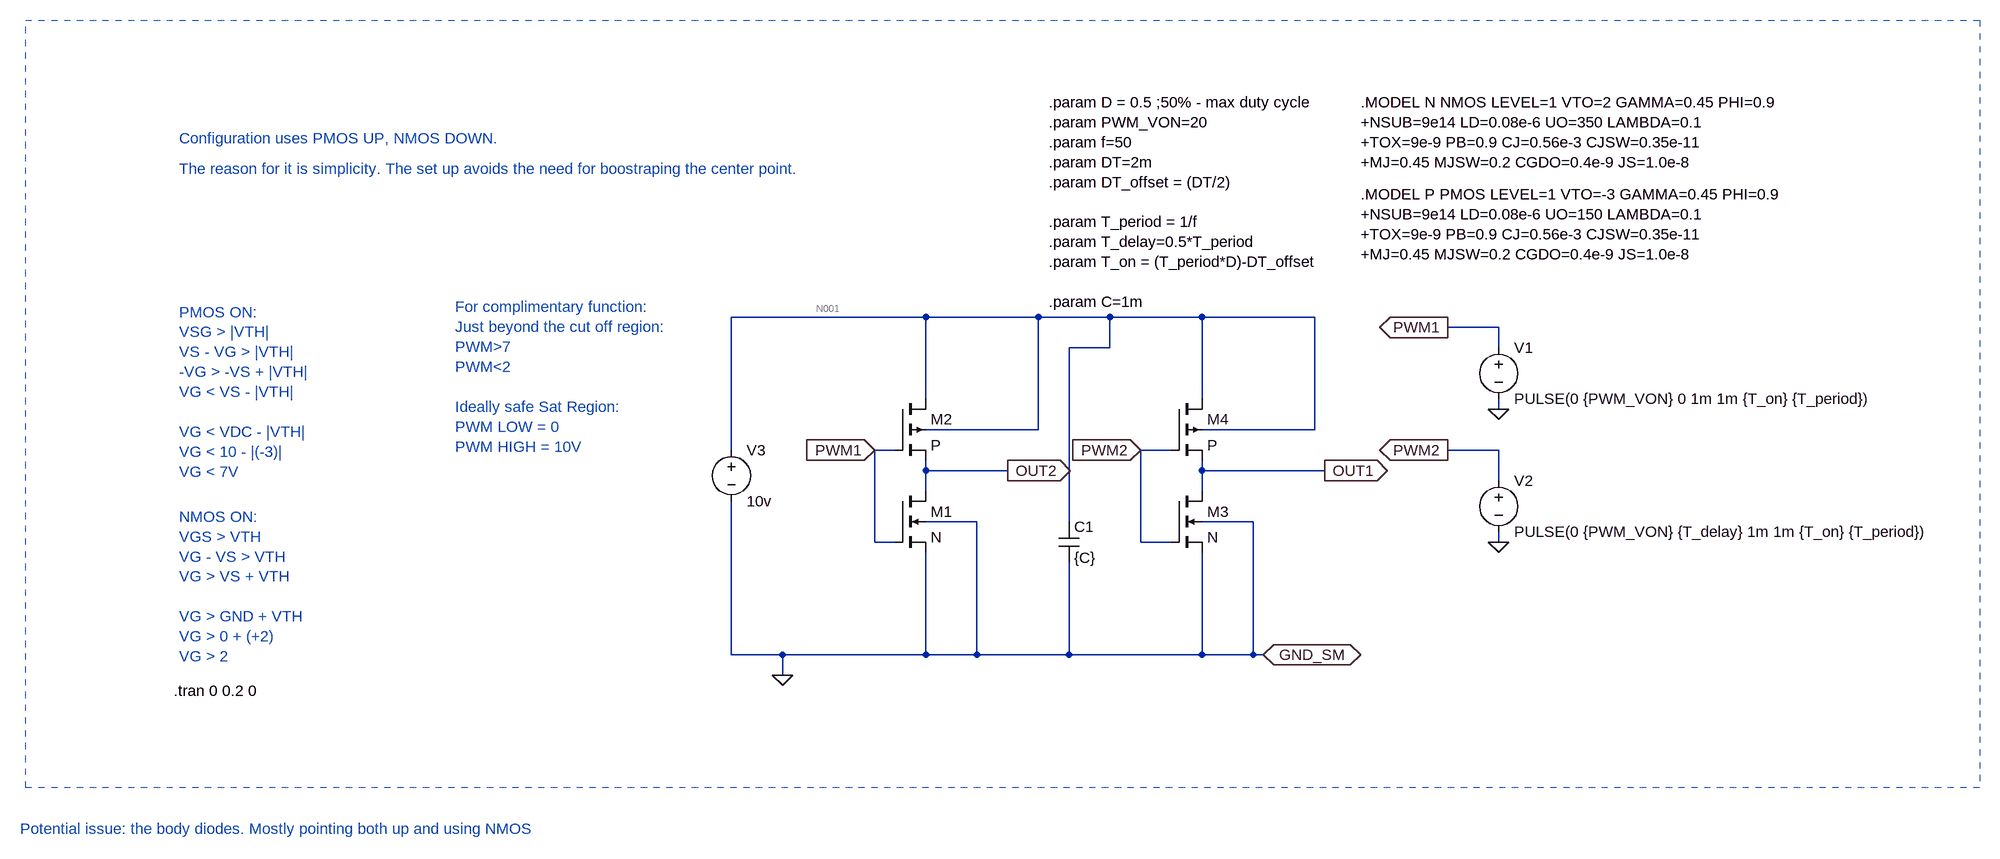
[diagram p0: schematic H-Bridge-SM.asc]
H-Bridge-SM.asc, the LTspice schematic file:
Version 4.1
SHEET 1 3540 848
WIRE 1728 32 1424 32
WIRE 1904 32 1728 32
WIRE 2016 32 1904 32
WIRE 2160 32 2016 32
WIRE 2336 32 2160 32
WIRE 2624 48 2544 48
WIRE 2016 80 2016 32
WIRE 2016 80 1952 80
WIRE 2624 80 2624 48
WIRE 1728 160 1728 32
WIRE 2160 160 2160 32
WIRE 2624 176 2624 160
WIRE 1904 208 1904 32
WIRE 1904 208 1728 208
WIRE 2336 208 2336 32
WIRE 2336 208 2160 208
WIRE 1424 240 1424 32
WIRE 1680 240 1648 240
WIRE 2112 240 2064 240
WIRE 2624 240 2544 240
WIRE 1728 272 1728 256
WIRE 1856 272 1728 272
WIRE 2160 272 2160 256
WIRE 2352 272 2160 272
WIRE 2624 288 2624 240
WIRE 1728 304 1728 272
WIRE 2160 304 2160 272
WIRE 1808 352 1728 352
WIRE 1952 352 1952 80
WIRE 2240 352 2160 352
WIRE 1648 384 1648 240
WIRE 1680 384 1648 384
WIRE 2064 384 2064 240
WIRE 2112 384 2064 384
WIRE 2624 384 2624 368
WIRE 1424 560 1424 320
WIRE 1504 560 1424 560
WIRE 1728 560 1728 400
WIRE 1728 560 1504 560
WIRE 1808 560 1808 352
WIRE 1808 560 1728 560
WIRE 1952 560 1952 416
WIRE 1952 560 1808 560
WIRE 2160 560 2160 400
WIRE 2160 560 1952 560
WIRE 2240 560 2240 352
WIRE 2240 560 2160 560
WIRE 2256 560 2240 560
WIRE 1504 592 1504 560
FLAG 1648 240 PWM1
IOPIN 1648 240 In
FLAG 2064 240 PWM2
IOPIN 2064 240 In
FLAG 1856 272 OUT2
IOPIN 1856 272 Out
FLAG 2352 272 OUT1
IOPIN 2352 272 Out
FLAG 2624 176 0
FLAG 2624 384 0
FLAG 2544 48 PWM1
IOPIN 2544 48 Out
FLAG 2544 240 PWM2
IOPIN 2544 240 Out
FLAG 2256 560 GND_SM
IOPIN 2256 560 BiDir
FLAG 1504 592 0
SYMBOL nmos4 1680 304 R0
SYMATTR InstName M1
SYMATTR Value N
SYMBOL pmos4 1680 160 R0
SYMATTR InstName M2
SYMATTR Value P
SYMBOL nmos4 2112 304 R0
SYMATTR InstName M3
SYMATTR Value N
SYMBOL pmos4 2112 160 R0
SYMATTR InstName M4
SYMATTR Value P
SYMBOL voltage 2624 64 R0
WINDOW 123 0 0 Left 0
WINDOW 39 0 0 Left 0
SYMATTR InstName V1
SYMATTR Value PULSE(0 {PWM_VON} 0 1m 1m {T_on} {T_period})
SYMBOL voltage 2624 272 R0
WINDOW 123 0 0 Left 0
WINDOW 39 0 0 Left 0
SYMATTR InstName V2
SYMATTR Value PULSE(0 {PWM_VON} {T_delay} 1m 1m {T_on} {T_period})
SYMBOL voltage 1424 224 R0
WINDOW 123 0 0 Left 0
WINDOW 39 0 0 Left 0
SYMATTR InstName V3
SYMATTR Value 10v
SYMBOL cap 1936 352 R0
SYMATTR InstName C1
SYMATTR Value {C}
TEXT 2408 -304 Left 2 !.MODEL N NMOS LEVEL=1 VTO=2 GAMMA=0.45 PHI=0.9\n+NSUB=9e14 LD=0.08e-6 UO=350 LAMBDA=0.1\n+TOX=9e-9 PB=0.9 CJ=0.56e-3 CJSW=0.35e-11\n+MJ=0.45 MJSW=0.2 CGDO=0.4e-9 JS=1.0e-8
TEXT 2408 -160 Left 2 !.MODEL P PMOS LEVEL=1 VTO=-3 GAMMA=0.45 PHI=0.9\n+NSUB=9e14 LD=0.08e-6 UO=150 LAMBDA=0.1\n+TOX=9e-9 PB=0.9 CJ=0.56e-3 CJSW=0.35e-11\n+MJ=0.45 MJSW=0.2 CGDO=0.4e-9 JS=1.0e-8
TEXT 560 -248 Left 2 ;Configuration uses PMOS UP, NMOS DOWN.
TEXT 560 -200 Left 2 ;The reason for it is simplicity. The set up avoids the need for boostraping the center point.
TEXT 560 24 Left 2 ;PMOS ON: \nVSG > |VTH| \nVS - VG > |VTH| \n-VG > -VS + |VTH| \nVG < VS - |VTH| \n \nVG < VDC - |VTH| \nVG < 10 - |(-3)|\nVG < 7V
TEXT 560 344 Left 2 ;NMOS ON:\nVGS > VTH\nVG - VS > VTH \nVG > VS + VTH\n \nVG > GND + VTH \nVG > 0 + (+2) \nVG > 2
TEXT 992 16 Left 2 ;For complimentary function: \nJust beyond the cut off region: \nPWM>7 \nPWM<2\n \nIdeally safe Sat Region: \nPWM LOW = 0\nPWM HIGH = 10V
TEXT 552 616 Left 2 !.tran 0 0.2 0
TEXT 1920 -304 Left 2 !.param D = 0.5 ;50% - max duty cycle\n.param PWM_VON=20\n.param f=50\n.param DT=2m\n.param DT_offset = (DT/2)\n \n.param T_period = 1/f\n.param T_delay=0.5*T_period\n.param T_on = (T_period*D)-DT_offset\n \n.param C=1m
TEXT 312 832 Left 2 ;Potential issue: the body diodes. Mostly pointing both up and using NMOS
RECTANGLE Normal 3376 768 320 -432 2

The netlist it stands for:
* H-Bridge-SM.asc
M1 OUT2 PWM1 0 0 N
M2 N001 PWM1 OUT2 N001 P
M3 OUT1 PWM2 0 0 N
M4 N001 PWM2 OUT1 N001 P
V1 PWM1 0 PULSE(0 {PWM_VON} 0 1m 1m {T_on} {T_period})
V2 PWM2 0 PULSE(0 {PWM_VON} {T_delay} 1m 1m {T_on} {T_period})
V3 N001 0 10v
C1 N001 0 {C}
.model NMOS NMOS
.model PMOS PMOS
.lib standard.mos
.MODEL N NMOS LEVEL=1 VTO=2 GAMMA=0.45 PHI=0.9
+NSUB=9e14 LD=0.08e-6 UO=350 LAMBDA=0.1
+TOX=9e-9 PB=0.9 CJ=0.56e-3 CJSW=0.35e-11
+MJ=0.45 MJSW=0.2 CGDO=0.4e-9 JS=1.0e-8
.MODEL P PMOS LEVEL=1 VTO=-3 GAMMA=0.45 PHI=0.9
+NSUB=9e14 LD=0.08e-6 UO=150 LAMBDA=0.1
+TOX=9e-9 PB=0.9 CJ=0.56e-3 CJSW=0.35e-11
+MJ=0.45 MJSW=0.2 CGDO=0.4e-9 JS=1.0e-8
* Configuration uses PMOS UP, NMOS DOWN.
* The reason for it is simplicity. The set up avoids the need for boostraping the center point.
* PMOS ON:
* VSG > |VTH|
* VS - VG > |VTH|
* -VG > -VS + |VTH|
* VG < VS - |VTH|
* VG < VDC - |VTH|
* VG < 10 - |(-3)|
* VG < 7V
* NMOS ON:
* VGS > VTH
* VG - VS > VTH
* VG > VS + VTH
* VG > GND + VTH
* VG > 0 + (+2)
* VG > 2
* For complimentary function:
* Just beyond the cut off region:
* PWM>7
* PWM<2
* Ideally safe Sat Region:
* PWM LOW = 0
* PWM HIGH = 10V
.tran 0 0.2 0
.param D = 0.5 ;50% - max duty cycle
.param PWM_VON=20
.param f=50
.param DT=2m
.param DT_offset = (DT/2)
.param T_period = 1/f
.param T_delay=0.5*T_period
.param T_on = (T_period*D)-DT_offset
.param C=1m
* Potential issue: the body diodes. Mostly pointing both up and using NMOS
.backanno
.end

* Results of the author's LTspice run, read from the files saved beside the schematic
* Operating Point, zero values left out:
*   V(out1) = 10 V
*   V(out2) = 10 V
*   V(n001) = 10 V
*   Id(M1) = 20.01 pA
*   Is(M1) = -10 pA
*   Ib(M1) = -10.01 pA
*   Id(M3) = 20.01 pA
*   Is(M3) = -10 pA
*   Ib(M3) = -10.01 pA
*   Id(M4) = -2.023 nA
*   Is(M4) = 2.023 nA
*   Id(M2) = -2.023 nA
*   Is(M2) = 2.023 nA
*   I(V3) = -40.03 pA
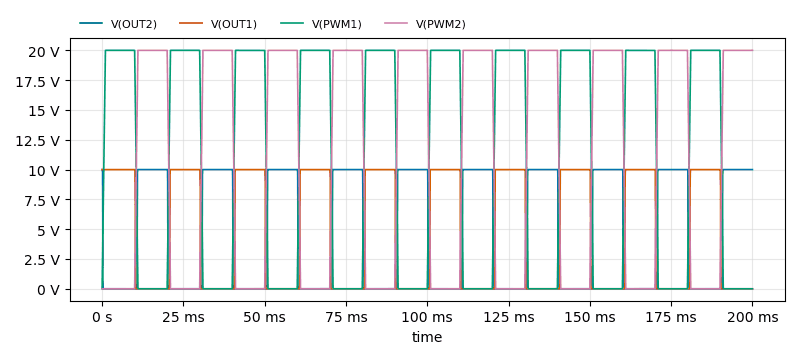
[diagram p1: Transient Analysis of H-Bridge-SM.asc, plotted from the saved traces]
* Transient Analysis, 1 run:
*   V(OUT2): min -510 µV, max 10 V, average 4.701 V, rms 6.843 V, last 10 V
*   V(OUT1): min -523.5 µV, max 10 V, average 4.741 V, rms 6.872 V, last 0 V
*   V(PWM1): min 0 V, max 20 V, average 10 V, rms 13.9 V, last 0 V
*   V(PWM2): min 0 V, max 20 V, average 9.95 V, rms 13.88 V, last 20 V